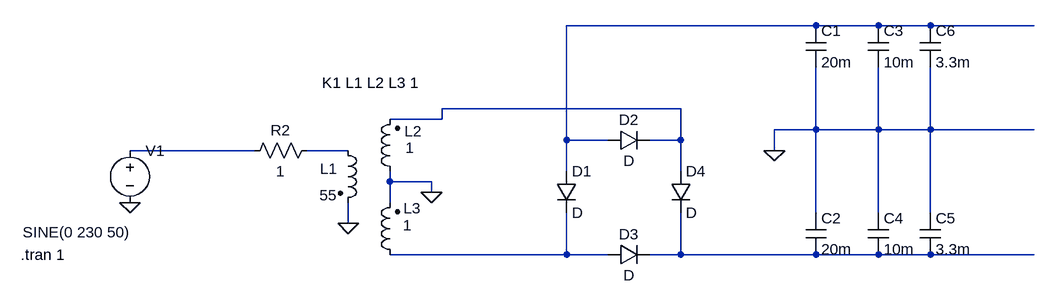
[diagram p0: schematic unregulated_supply.asc]
unregulated_supply.asc, the LTspice schematic file:
Version 4
SHEET 1 880 680
WIRE 448 -160 64 -160
WIRE 544 -160 448 -160
WIRE 624 -160 544 -160
WIRE 784 -160 624 -160
WIRE 240 -32 -128 -32
WIRE -128 -16 -128 -32
WIRE -128 -16 -208 -16
WIRE 448 0 448 -96
WIRE 448 0 384 0
WIRE 544 0 544 -96
WIRE 544 0 448 0
WIRE 624 0 624 -96
WIRE 624 0 544 0
WIRE 784 0 624 0
WIRE 64 16 64 -160
WIRE 128 16 64 16
WIRE 240 16 240 -32
WIRE 240 16 192 16
WIRE -416 32 -608 32
WIRE -272 32 -336 32
WIRE 384 32 384 0
WIRE 64 64 64 16
WIRE 240 64 240 16
WIRE -208 80 -208 64
WIRE -144 80 -208 80
WIRE -144 96 -144 80
WIRE -208 112 -208 80
WIRE 448 128 448 0
WIRE 544 128 544 0
WIRE 624 128 624 0
WIRE -272 144 -272 112
WIRE 64 192 64 128
WIRE 64 192 -208 192
WIRE 128 192 64 192
WIRE 240 192 240 128
WIRE 240 192 192 192
WIRE 448 192 240 192
WIRE 544 192 448 192
WIRE 624 192 544 192
WIRE 784 192 624 192
FLAG -608 112 0
FLAG -272 144 0
FLAG -144 96 0
FLAG 384 32 0
SYMBOL diode 48 64 R0
SYMATTR InstName D1
SYMBOL diode 128 32 R270
WINDOW 0 32 32 VTop 2
WINDOW 3 0 32 VBottom 2
SYMATTR InstName D2
SYMBOL diode 128 208 R270
WINDOW 0 32 32 VTop 2
WINDOW 3 0 32 VBottom 2
SYMATTR InstName D3
SYMBOL diode 224 64 R0
SYMATTR InstName D4
SYMBOL voltage -608 16 R0
WINDOW 3 -165 142 Left 2
WINDOW 123 0 0 Left 0
WINDOW 39 0 0 Left 0
SYMATTR Value SINE(0 230 50)
SYMATTR InstName V1
SYMBOL res -320 16 R90
WINDOW 0 0 56 VBottom 2
WINDOW 3 32 56 VTop 2
SYMATTR InstName R2
SYMATTR Value 1
SYMBOL ind2 -288 16 R0
WINDOW 0 -27 44 Left 2
WINDOW 3 -28 85 Left 2
SYMATTR InstName L1
SYMATTR Value 55
SYMATTR Type ind
SYMBOL ind2 -192 80 R180
WINDOW 0 -34 78 Left 2
WINDOW 3 -22 52 Left 2
SYMATTR InstName L2
SYMATTR Value 1
SYMATTR Type ind
SYMBOL ind2 -192 208 R180
WINDOW 0 -32 87 Left 2
WINDOW 3 -18 61 Left 2
SYMATTR InstName L3
SYMATTR Value 1
SYMATTR Type ind
SYMBOL cap 432 -160 R0
SYMATTR InstName C1
SYMATTR Value 20m
SYMBOL cap 432 128 R0
SYMATTR InstName C2
SYMATTR Value 20m
SYMBOL cap 528 -160 R0
SYMATTR InstName C3
SYMATTR Value 10m
SYMBOL cap 528 128 R0
SYMATTR InstName C4
SYMATTR Value 10m
SYMBOL cap 608 128 R0
SYMATTR InstName C5
SYMATTR Value 3.3m
SYMBOL cap 608 -160 R0
SYMATTR InstName C6
SYMATTR Value 3.3m
TEXT -776 192 Left 2 !.tran 1
TEXT -312 -72 Left 2 !K1 L1 L2 L3 1

The netlist it stands for:
* unregulated_supply.asc
D1 N001 N005 D
D2 N001 N002 D
D3 N005 N006 D
D4 N002 N006 D
V1 N003 0 SINE(0 230 50)
R2 N004 N003 1
L1 N004 0 55
L2 0 N002 1
L3 N005 0 1
C1 N001 0 20m
C2 0 N006 20m
C3 N001 0 10m
C4 0 N006 10m
C5 0 N006 3.3m
C6 N001 0 3.3m
.model D D
.lib standard.dio
.tran 1
K1 L1 L2 L3 1
.backanno
.end